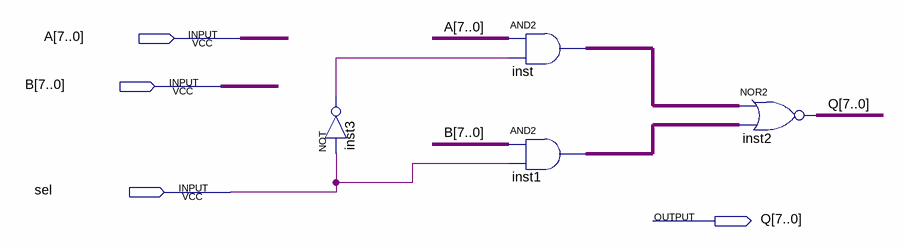
[diagram p0: schematic sheet]
// Quartus schematic selector.bdf as structural Verilog: 4 symbols, 4 pins
module selector (
  input  [7:0] A,
  input  [7:0] B,
  input  sel,
  output [7:0] Q
);

  wire inst3_out;
  wire [7:0] inst1_out, inst_out;

  not inst3 (inst3_out, sel);
  assign inst_out = A & {8{inst3_out}};  // AND2 inst, 8 bits wide
  assign inst1_out = B & {8{sel}};  // AND2 inst1, 8 bits wide
  assign Q = ~(inst_out | inst1_out);  // NOR2 inst2, 8 bits wide
endmodule
